# EAGLE design MF01.v1.6 (EAGLE 7.5.0)

## Sheet 1 of 3
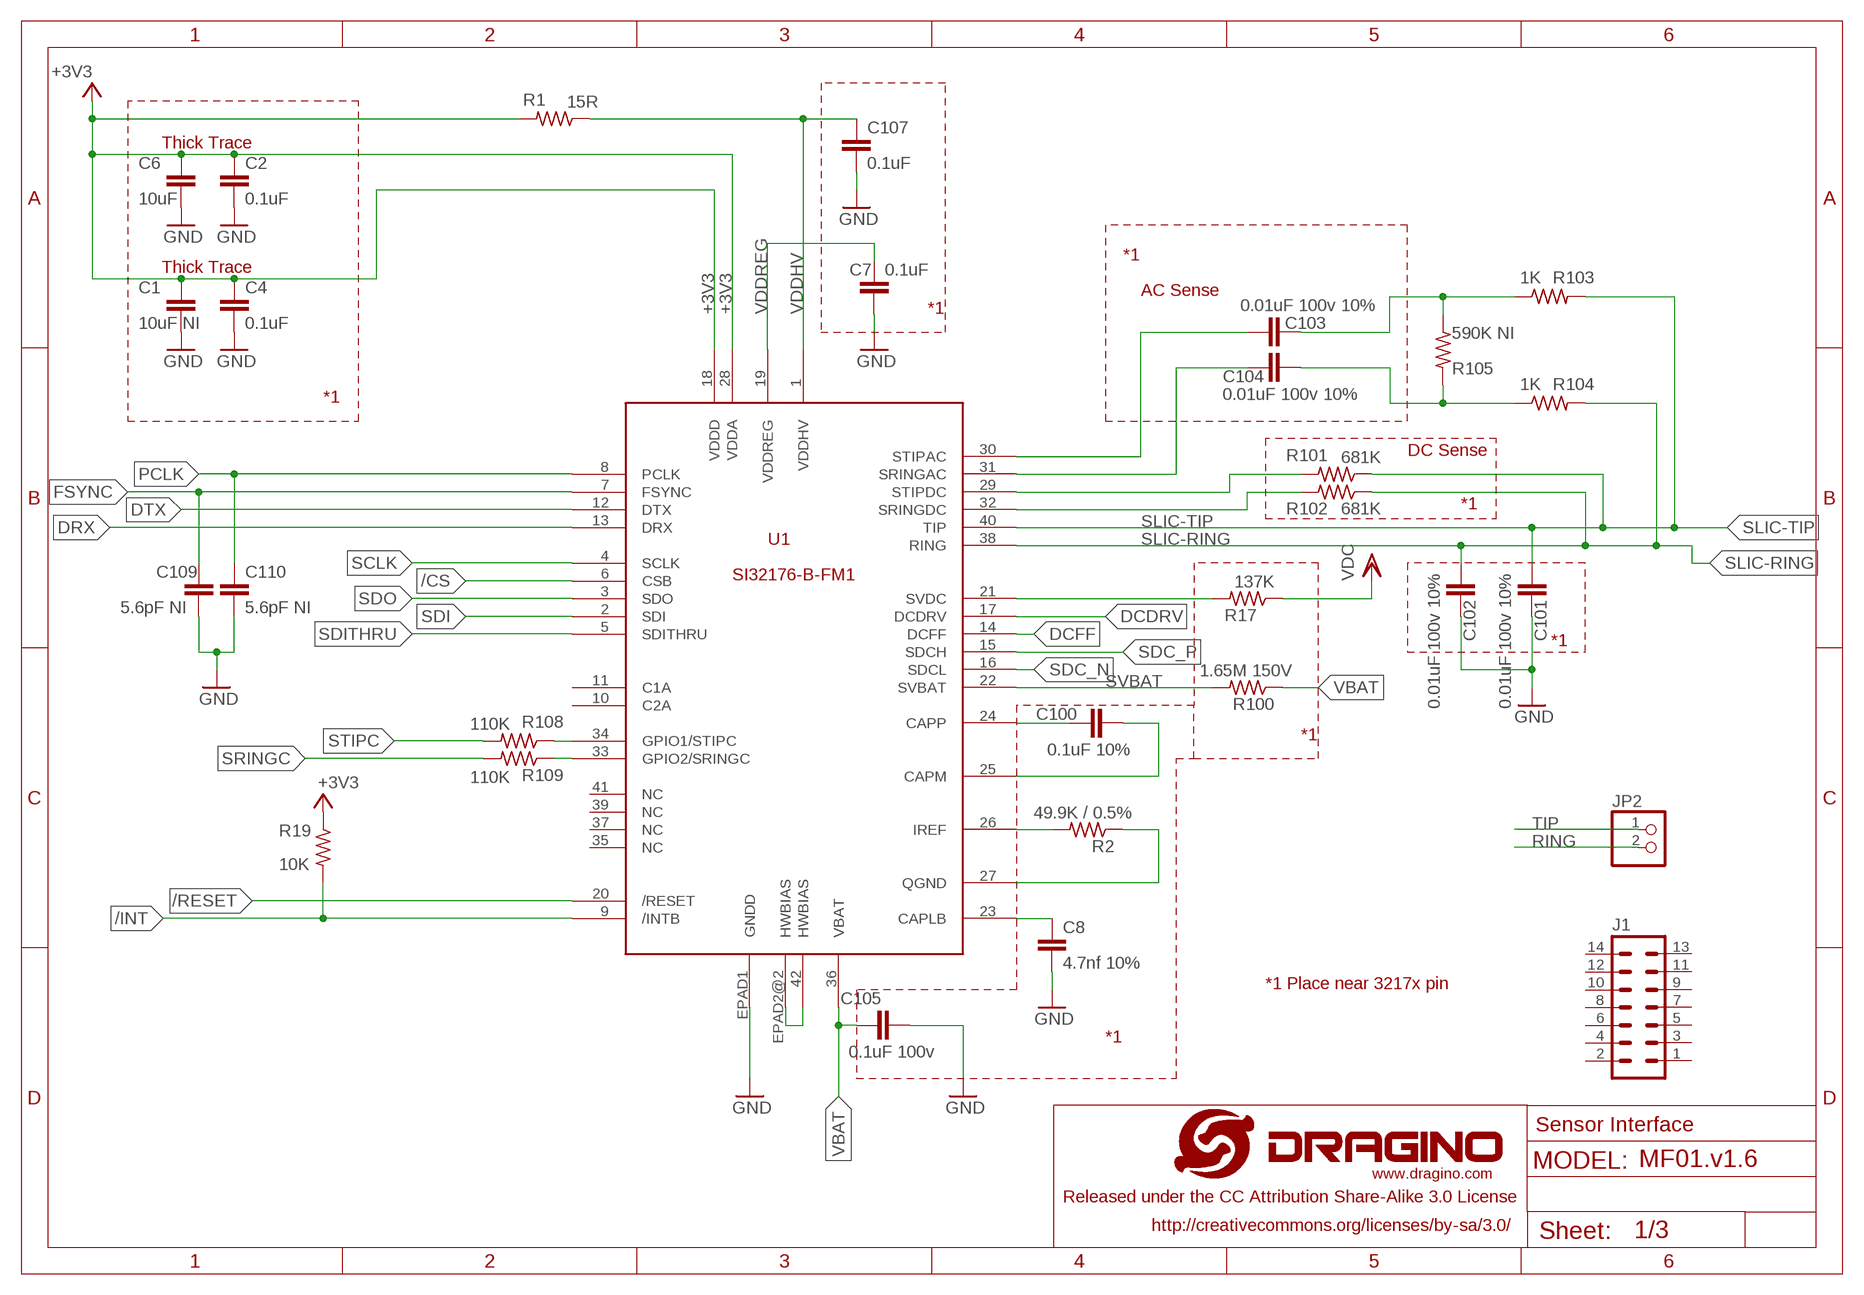
[diagram p0: schematic, sheet 1]

### Parts
C1  10uF NI  C-EUC0603  [C0603]
C2  0.1uF  C-EUC0402  [C0402]
C4  0.1uF  C-EUC0402  [C0402]
C6  10uF  C-EUC0603  [C0603]
C7  0.1uF  C-EUC0402  [C0402]
C8  4.7nf 10%  C-EUC0402  [C0402]
C100  0.1uF 10%  C-EUC0402  [C0402]
C101  0.01uF 100v 10%  C-EUC0603  [C0603]
C102  0.01uF 100v 10%  C-EUC0603  [C0603]
C103  0.01uF 100v 10%  C-EUC0603  [C0603]
C104  0.01uF 100v 10%  C-EUC0603  [C0603]
C105  0.1uF 100v  C-EUC0603  [C0603]
C107  0.1uF  C-EUC0402  [C0402]
C109  5.6pF NI  C-EUC0402  [C0402]
C110  5.6pF NI  C-EUC0402  [C0402]
J1  MA07-2  [MA07-2]
JP2  PINHD-1X2  [1X02]
R1  15R  R-US_R0805  [R0805]
R2  49.9K / 0.5%  R-US_R0402  [R0402]
R17  137K  R-US_R0402  [R0402]
R19  10K  R-US_R0402  [R0402]
R100  1.65M 150V  R-US_R0805  [R0805]
R101  681K  R-US_R0805  [R0805]
R102  681K  R-US_R0805  [R0805]
R103  1K  R-US_R0603  [R0603]
R104  1K  R-US_R0603  [R0603]
R105  590K NI  R-US_R0805  [R0805]
R108  110K  R-US_R0402  [R0402]
R109  110K  R-US_R0402  [R0402]
U1  SI32176-B-FM1  SI3217X  [SI3217X-QFN42]

### Nets
+3V3: C1.2 C2.2 C4.2 C6.2 R1.2 R19.1 U1.18(VDDD) U1.28(VDDA) ; also sheet 2
/CS: U1.6(CSB) ; also sheet 2
/INT: R19.2 U1.9(/INTB) ; also sheet 2
/RESET: U1.20(/RESET) ; also sheet 2
DCDRV: U1.17(DCDRV) ; also sheet 2
DCFF: U1.14(DCFF) ; also sheet 2
DRX: U1.13(DRX) ; also sheet 2
DTX: U1.12(DTX) ; also sheet 2
EPAD2: U1.42(HWBIAS) U1.EPAD2@2(HWBIAS)
FSYNC: C109.2 U1.7(FSYNC) ; also sheet 2
GND [gnd]: C1.1 C2.1 C4.1 C6.1 C7.1 C8.2 C101.2 C102.2 C105.1 C107.1 C109.1 C110.1 U1.EPAD1(GNDD) ; also sheet 2,3
N$1: R102.2 U1.32(SRINGDC)
N$11: R2.2 U1.26(IREF)
N$12: C8.1 U1.23(CAPLB)
N$16: R2.1 U1.27(QGND)
N$58: C100.1 U1.24(CAPP)
N$59: C100.2 U1.25(CAPM)
N$60: R101.2 U1.29(STIPDC)
N$61: C104.1 U1.31(SRINGAC)
N$62: C103.1 U1.30(STIPAC)
N$63: C104.2 R104.1 R105.2
N$64: C103.2 R103.1 R105.1
N$65: R17.2 U1.21(SVDC)
N$66: R108.1 U1.34(GPIO1/STIPC)
N$67: R109.1 U1.33(GPIO2/SRINGC)
PCLK: C110.2 U1.8(PCLK) ; also sheet 2
RING: JP2.2 ; also sheet 3
SCLK: U1.4(SCLK) ; also sheet 2
SDC_N: U1.16(SDCL) ; also sheet 2
SDC_P: U1.15(SDCH) ; also sheet 2
SDI: U1.2(SDI) ; also sheet 2
SDITHRU: U1.5(SDITHRU)
SDO: U1.3(SDO) ; also sheet 2
SLIC-RING: C102.1 R102.1 R104.2 U1.38(RING) ; also sheet 3
SLIC-TIP: C101.1 R101.1 R103.2 U1.40(TIP) ; also sheet 3
SRINGC: R109.2 ; also sheet 3
STIPC: R108.2 ; also sheet 3
SVBAT: R100.2 U1.22(SVBAT)
TIP: JP2.1 ; also sheet 3
VBAT: C105.2 R100.1 U1.36(VBAT) ; also sheet 2
VDC: R17.1 ; also sheet 2
VDDHV: C107.2 R1.1 U1.1(VDDHV)
VDDREG: C7.2 U1.19(VDDREG)
Unconnected: J1.1 J1.2 J1.3 J1.4 J1.5 J1.6 J1.7 J1.8 J1.9 J1.10 J1.11 J1.12 J1.13 J1.14 U1.10(C2A) U1.11(C1A) U1.35(NC) U1.37(NC) U1.39(NC) U1.41(NC)

### Notes on the sheet
- Thick Trace
- Thick Trace | *1
- AC Sense
- *1
- *1
- DC Sense
- *1
- *1
- *1
- *1 Place near 3217x pin
- *1
- Sensor Interface

## Sheet 2 of 3
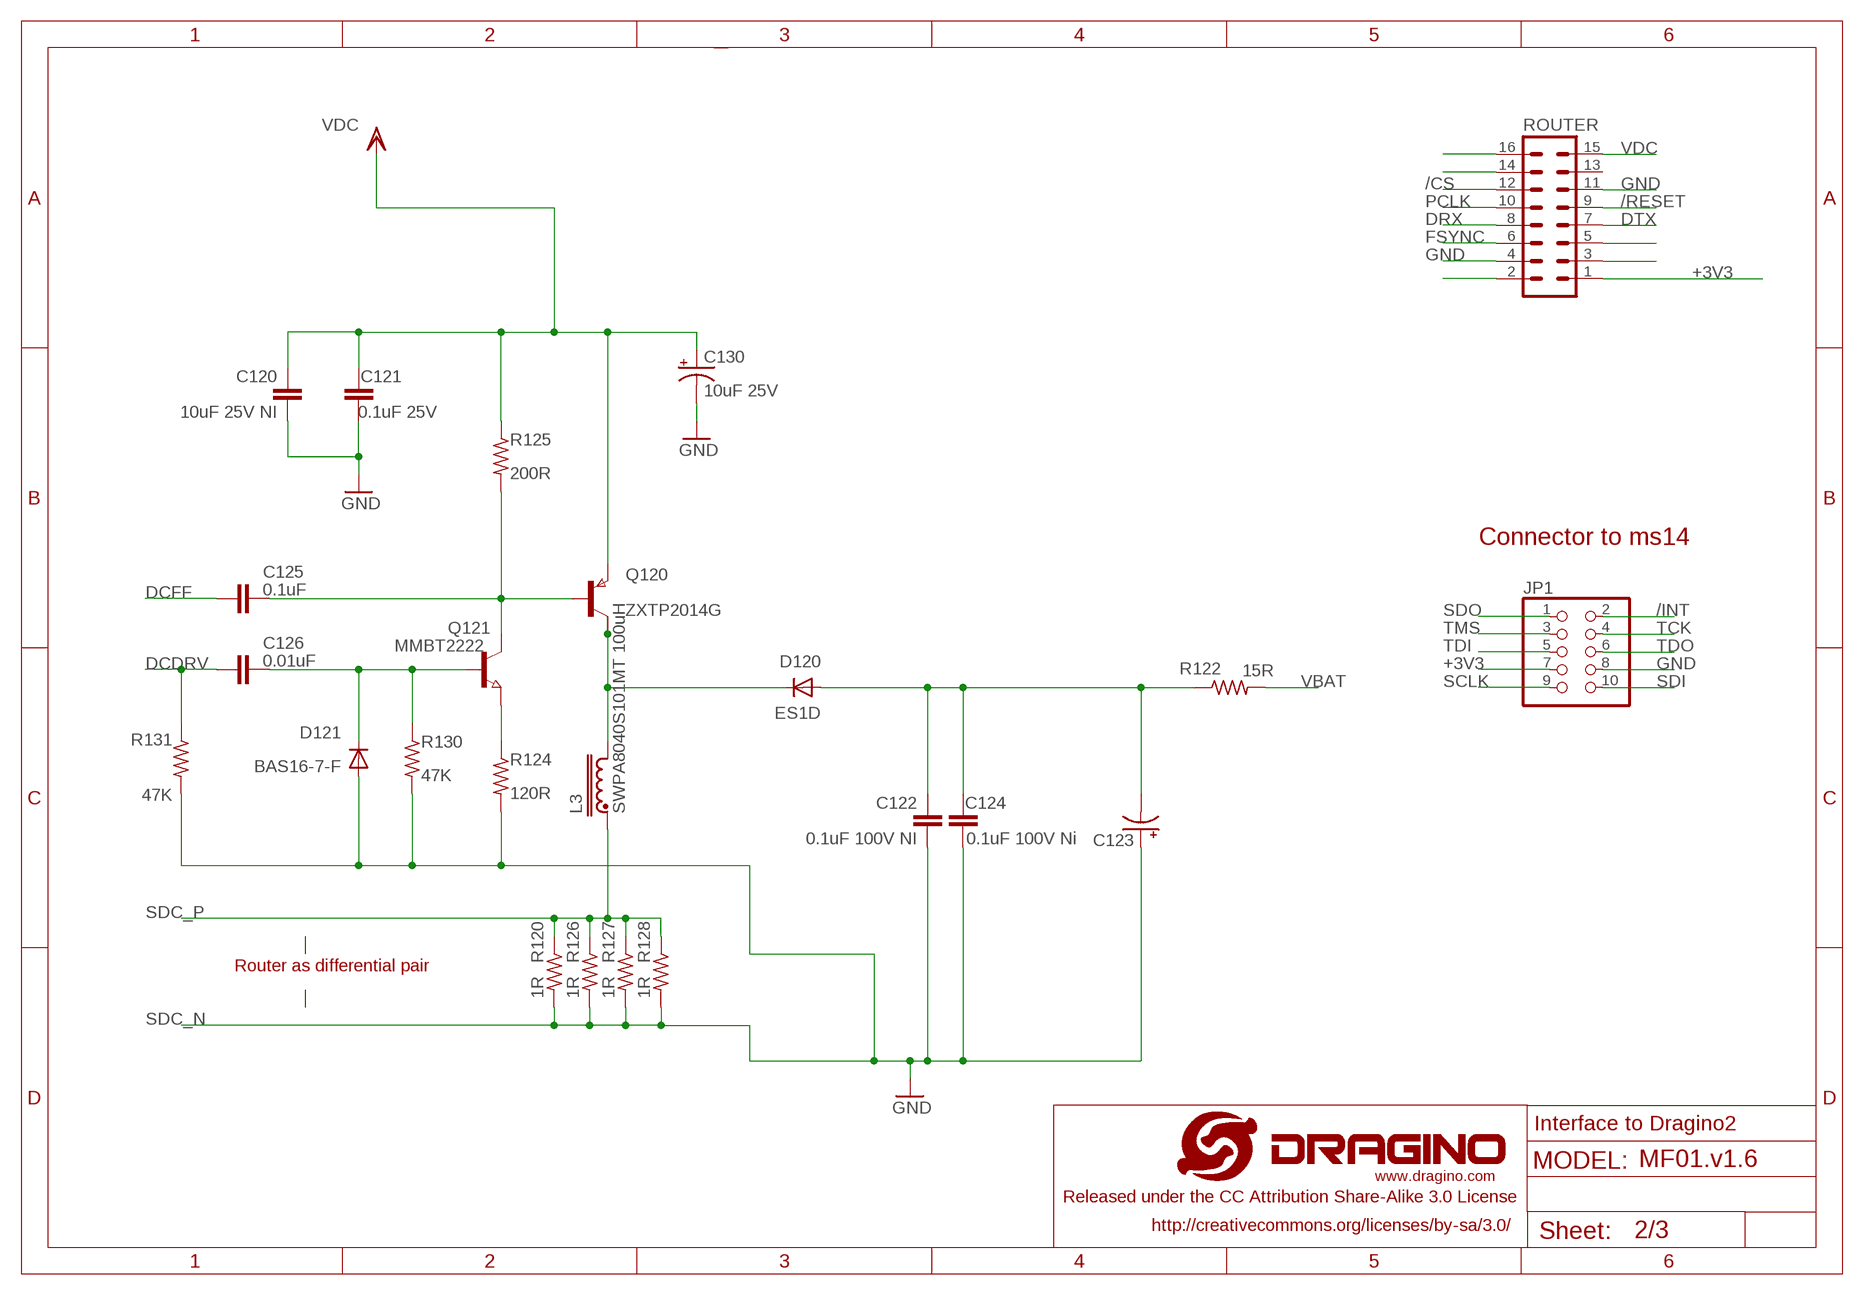
[diagram p1: schematic, sheet 2]

### Parts
C120  10uF 25V NI  C-EUC1206  [C1206]
C121  0.1uF 25V  C-EUC0402  [C0402]
C122  0.1uF 100V NI  C-EUC0603  [C0603]
C123  CPOL-US153CLV-0605  [153CLV-0605]
C124  0.1uF 100V Ni  C-EUC0603  [C0603]
C125  0.1uF  C-EUC0402  [C0402]
C126  0.01uF  C-EUC0402  [C0402]
C130  10uF 25V  CPOL-USUD-4X5,8  [UD-4X5,8_NICHICON]
D120  ES1D  CGRM4001-G  [SOD-123_MINI-SMA]
D121  BAS16-7-F  [SOT23]
JP1  PINHD-2X5_2.00  [2X05M]
L3  SWPA8040S101MT 100uH  INDUCTORLVS808040  [LVS808040]
Q120  ZXTP2014G  PNPSOT223  [SOT223]
Q121  MMBT2222  NPN-TRANSISTOR_SOT23  [SOT23]
R120  1R  R-US_R0402  [R0402]
R122  15R  R-US_R0805  [R0805]
R124  120R  R-US_R0402  [R0402]
R125  200R  R-US_R0603  [R0603]
R126  1R  R-US_R0402  [R0402]
R127  1R  R-US_R0402  [R0402]
R128  1R  R-US_R0402  [R0402]
R130  47K  R-US_R0402  [R0402]
R131  47K  R-US_R0402  [R0402]
ROUTER  MA08-2  [MA08-2]
U$5  LOGO-NEW  [LOGO-SILK-NEW]

### Nets
+3V3: JP1.7 ROUTER.1 ; also sheet 1
/CS: ROUTER.12 ; also sheet 1
/INT: JP1.2 ; also sheet 1
/RESET: ROUTER.9 ; also sheet 1
DCDRV: C126.2 R131.1 ; also sheet 1
DCFF: C125.2 ; also sheet 1
DRX: ROUTER.8 ; also sheet 1
DTX: ROUTER.7 ; also sheet 1
FSYNC: ROUTER.6 ; also sheet 1
GND [gnd]: C120.2 C121.2 C122.2 C123.+ C124.2 C130.- D121.1(A) JP1.8 R124.2 R130.2 R131.2 ROUTER.4 ROUTER.11 ; also sheet 1,3
N$4: ROUTER.3
N$8: C126.1 D121.3(C) Q121.1(B) R130.1
N$9: Q121.2(E) R124.1
N$68: C125.1 Q120.1(B) Q121.3(C) R125.2
N$69: D120.C L3.P$2 Q120.2(C) Q120.4(C)
N$70: C122.1 C123.- C124.1 D120.A R122.1
N$73: ROUTER.5
N$74: ROUTER.16
N$75: ROUTER.14
N$76: ROUTER.2
PCLK: ROUTER.10 ; also sheet 1
SCLK: JP1.9 ; also sheet 1
SDC_N: R120.2 R126.2 R127.2 R128.2 ; also sheet 1
SDC_P: L3.P$1 R120.1 R126.1 R127.1 R128.1 ; also sheet 1
SDI: JP1.10 ; also sheet 1
SDO: JP1.1 ; also sheet 1
TCK: JP1.4
TDI: JP1.5
TDO: JP1.6
TMS: JP1.3
VBAT: R122.2 ; also sheet 1
VDC: C120.1 C121.1 C130.+ Q120.3(E) R125.1 ROUTER.15 ; also sheet 1
Unconnected: ROUTER.13

### Notes on the sheet
- Connector to ms14
- Router as differential pair
- Interface to Dragino2

## Sheet 3 of 3
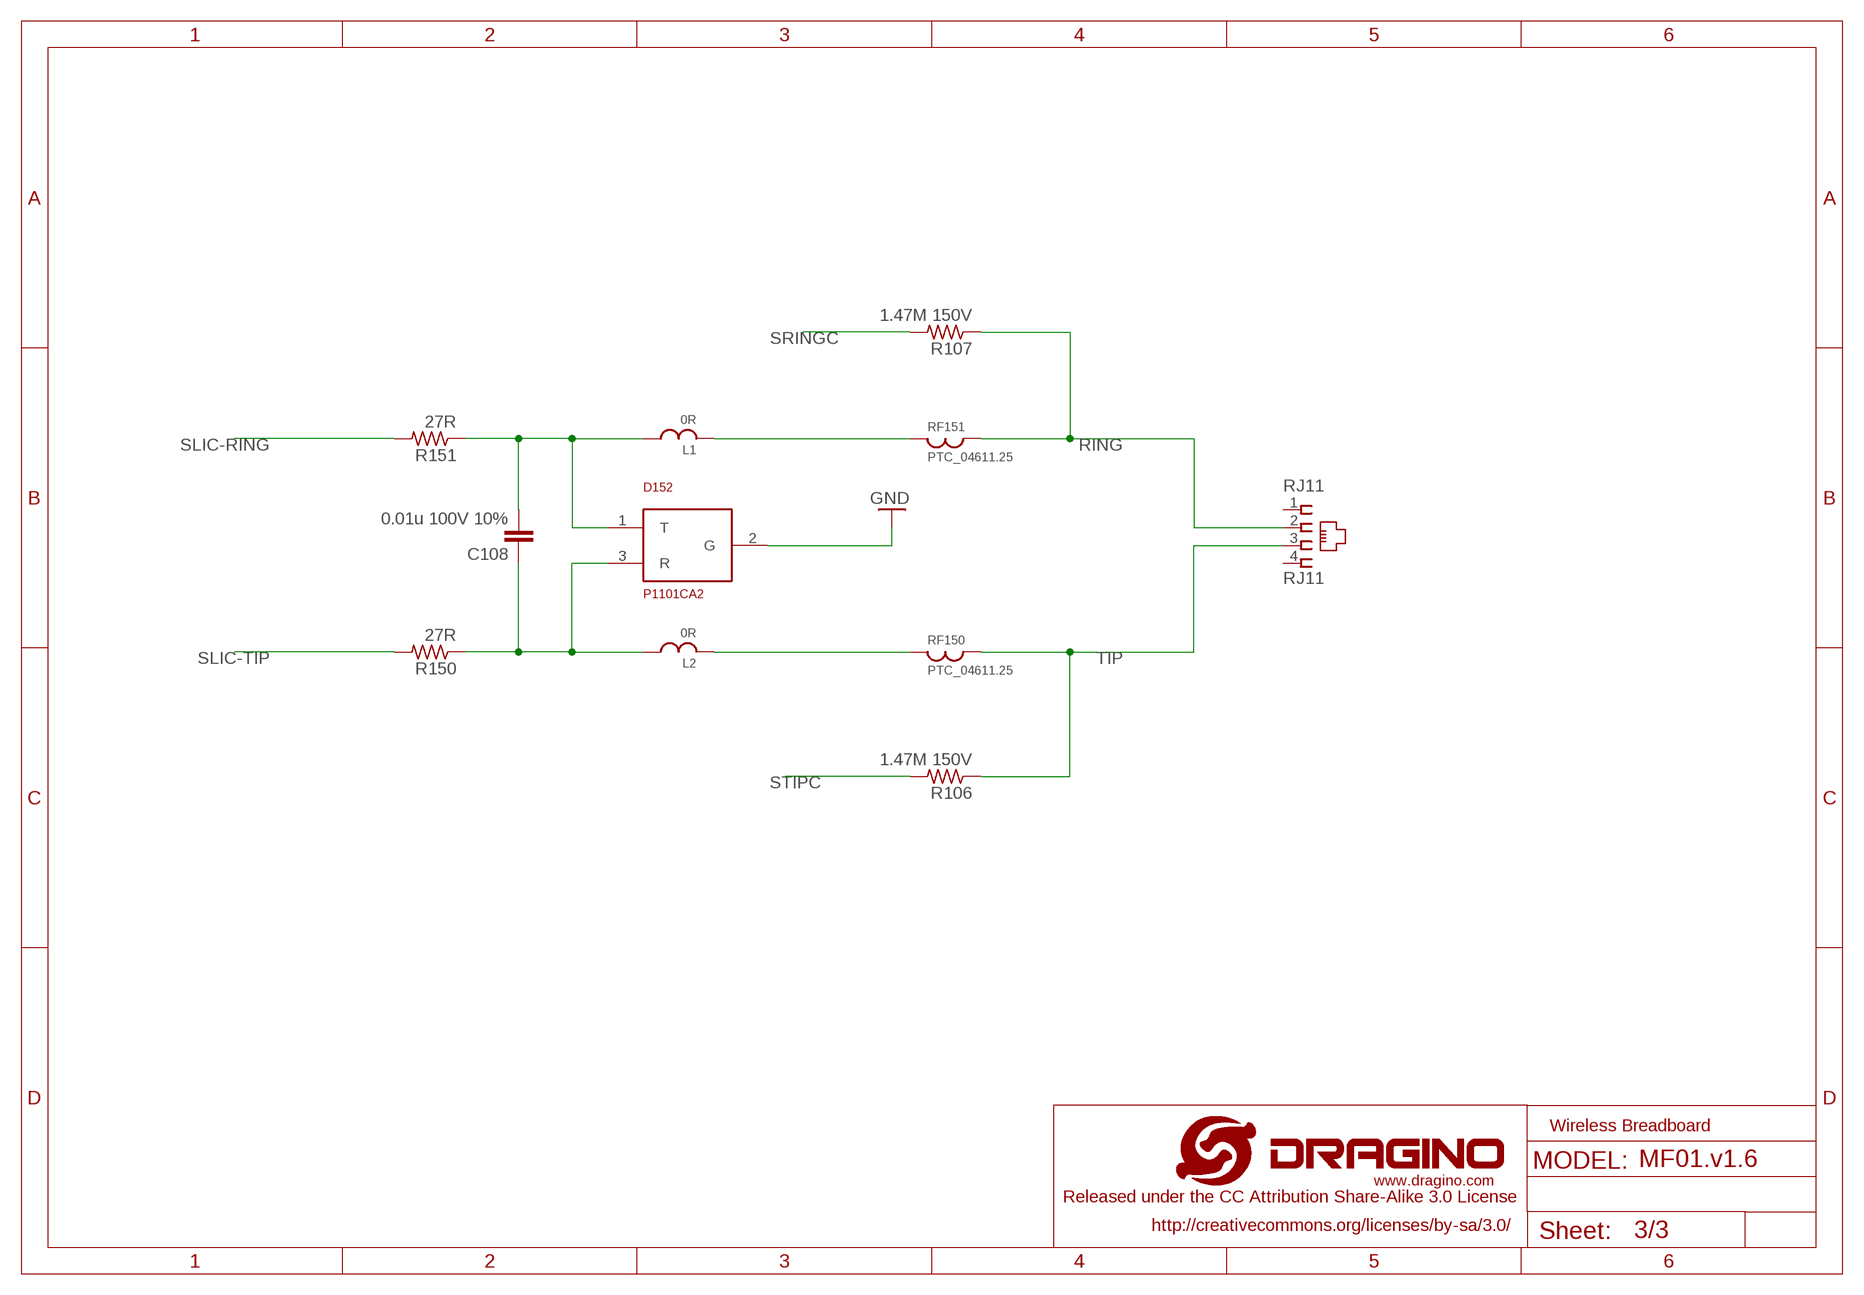
[diagram p2: schematic, sheet 3]

### Parts
C108  0.01u 100V 10%  C-EUC0603  [C0603]
D152  P1101CA2  SLIC_PROTECTORP1101CA2  [DO-214]
L1  0R  BEADS0805  [C0805]
L2  0R  BEADS0805  [C0805]
R106  1.47M 150V  R-US_R1206  [R1206]
R107  1.47M 150V  R-US_R1206  [R1206]
R150  27R  R-US_R0805  [R0805]
R151  27R  R-US_R0805  [R0805]
RF150  PTC_04611.25  [04611.25]
RF151  PTC_04611.25  [04611.25]
RJ11  RJ11  14867RJ11  [14867]

### Nets
GND [gnd]: D152.2(G) ; also sheet 1,2
N$3: L1.1 RF151.P1
N$5: L2.1 RF150.P1
N$71: C108.1 D152.3(R) L2.2 R150.1
N$72: C108.2 D152.1(T) L1.2 R151.1
RING: R107.1 RF151.P2 RJ11.2 ; also sheet 1
SLIC-RING: R151.2 ; also sheet 1
SLIC-TIP: R150.2 ; also sheet 1
SRINGC: R107.2 ; also sheet 1
STIPC: R106.2 ; also sheet 1
TIP: R106.1 RF150.P2 RJ11.3 ; also sheet 1
Unconnected: RJ11.1 RJ11.4

### Notes on the sheet
- Wireless Breadboard

## Library data of the parts
C1 C2 C4 C6-C8 C100-C105 C107-C110 C120-C122 C124-C126 = dragino:C-EU: CAPACITOR, European symbol
C123 = dragino:CPOL-US: POLARIZED CAPACITOR, American symbol
C130 = rcl:CPOL-US: POLARIZED CAPACITOR, American symbol
D120 = diode:CGRM400*-G: Molded plasitc,JEDEC SOD-123/Mini SMA Source: Comchip CGRM4001-G.pdf
D121 = dragino:BAS16-7-F
D152 = dragino:SLIC_PROTECTOR
J1 = dragino:MA07-2: PIN HEADER; OC_FARNELL: unknown; OC_NEWARK: unknown
JP1 = dragino:PINHD-2X5: PIN HEADER
JP2 = pinhead:PINHD-1X2: PIN HEADER
L1 L2 = dragino:BEADS
L3 = dragino-passive:INDUCTOR: CHOKE U15
Q120 = zetex:PNPSOT223: PNP TRANSISTOR; MPN: DJT4030P-13; OC_FARNELL: 1710675; OC_NEWARK: 25R4489
Q121 = semicon-smd-ipc:NPN-TRANSISTOR_: NPN TRANSISTOR
R1 R2 R17 R19 R100-R109 R120 R122 R124-R128 R130 R131 R150 R151 = dragino:R-US_: RESISTOR, American symbol
RF150 RF151 = dragino:PTC_04611.25
RJ11 = dragino:14867: RJ11 Connector Source: 4UCON TECHNOLOGY INC. 14867.pdf; OC_FARNELL: unknown; OC_NEWARK: unknown
ROUTER = dragino:MA08-2: PIN HEADER; OC_FARNELL: unknown; OC_NEWARK: unknown
U1 = dragino:SI3217X
U$5 = dragino:LOGO-NEW

## Net classes
0 default: width 0.203 mm, clearance 0.254 mm
1 power: width 0.61 mm, drill 0.61 mm, clearance 0.254 mm
2 gnd: width 0.305 mm, drill 0.33 mm, clearance 0.254 mm
3 usbvcc: width 0.508 mm, drill 0.61 mm, clearance 0.254 mm
4 aref: width 0.406 mm, drill 0.61 mm, clearance 0.254 mm
5 usbtrace: width 0.254 mm, clearance 0.152 mm

## Board
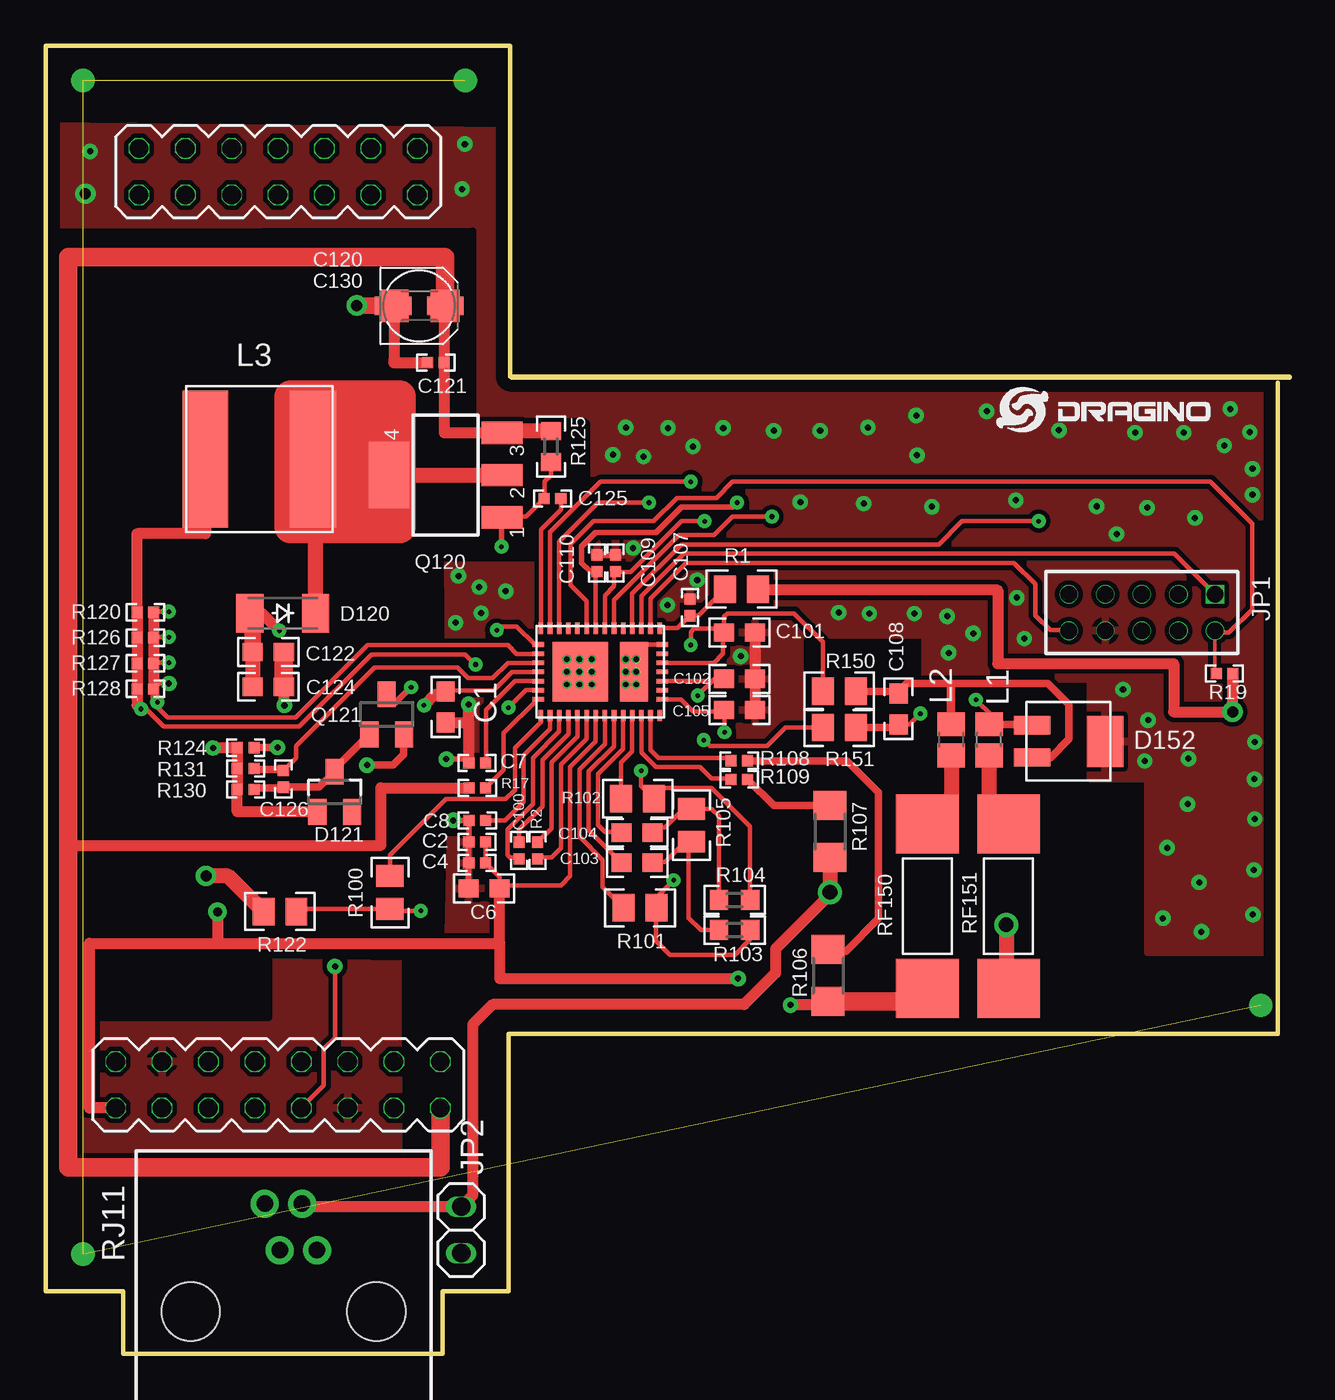
[diagram p3: board, top side]
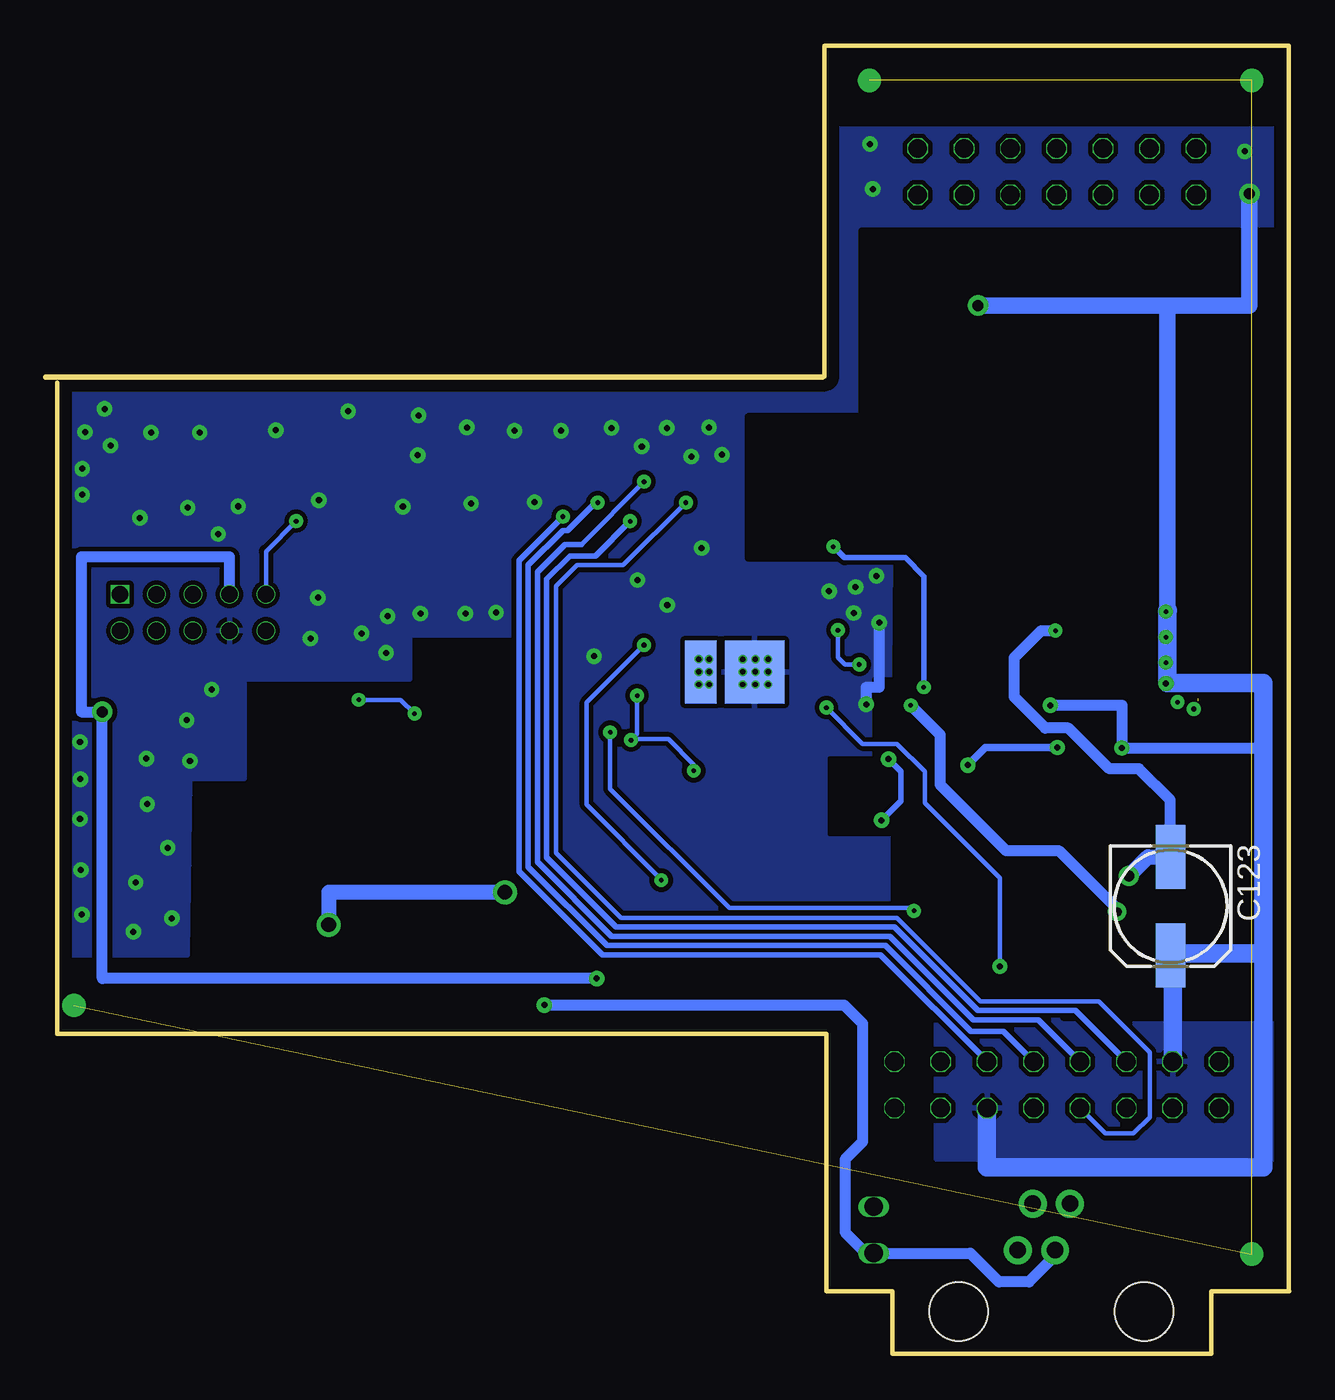
[diagram p4: board, bottom side, seen from below]

Size 68.09 x 71.63 mm. Coordinates in mm from the lower left corner, seen from the top.
Outline: 25.44,53.5 25.44,71.63 0.02,71.63 0.02,3.43
Outline: 67.45,53.19 67.45,17.53 25.35,17.53 25.35,3.43 21.73,3.43 21.73,0 4.26,0 4.26,3.43 0.02,3.43
Outline: 0.02,3.43 0,3.43
Outline: 25.54,53.47 68.09,53.47
Copper layers (1*16): Top 0.035mm / dielectric 1.5mm / Bottom 0.035mm
Design rules "default *": minimum track width 10mil, minimum drill 10mil, track to track 6mil, track to pad 7mil, pad to pad 7mil, via to via 10mil, smd to smd 7mil, copper to edge 26mil, drill to drill 10mil, minimum pad ring 1mil, minimum via ring 10mil, stop-mask expansion 1mil, vias tented up to drill 30mil, thermal gap 10mil
tRestrict: area 0.3,18.2 to 29.6,61.5; area 21.4,28.4 to 25.2,37
bRestrict: area 0.2,18.4 to 29.6,61.5; area 21.4,28.4 to 25.2,37

### Footprints (pad centres in the part's own frame; a part is rotated, then mirrored left to right if it is on the bottom)
C0603 = smd 1.1 x 1: 1 -0.85,0; 2 0.85,0
C0402 = smd 0.61 x 0.61: 1 -0.457,0; 2 0.457,0
C1206 = smd 1.6 x 1.8: 1 -1.4,0; 2 1.4,0
153CLV-0605 = smd 3.5 x 1.6: + 2.7,0; - -2.7,0
UD-4X5,8_NICHICON = smd 2 x 1: + 1.425,0; - -1.425,0
SOD-123_MINI-SMA = smd 1.5 x 2.1: A 1.8,0; C -1.8,0
SOT23 = smd 1 x 1.4: 1 -0.95,-1.1; 2 0.95,-1.1; 3 0,1.1
DO-214 = smd 2 x 1: 1 4,-0.88; 3 4,0.88 | smd 2 x 2.8: 2 0,0
MA07-2 = drill 1.016 octagon: 1 -7.62,-1.27; 2 -7.62,1.27; 3 -5.08,-1.27; 4 -5.08,1.27; 5 -2.54,-1.27; 6 -2.54,1.27; 7 0,-1.27; 8 0,1.27; 9 2.54,-1.27; 10 2.54,1.27; 11 5.08,-1.27; 12 5.08,1.27; 13 7.62,-1.27; 14 7.62,1.27
2X05M = drill 0.914 square: 1 -4,-1 | drill 0.914: 2 -4,1; 3 -2,-1; 4 -2,1; 5 0,-1; 6 0,1; 7 2,-1; 8 2,1; 9 4,-1; 10 4,1
1X02 = drill 1.016 long: 1 -1.27,0; 2 1.27,0
C0805 = smd 1.3 x 1.5: 1 -0.85,0; 2 0.85,0
LVS808040 = smd 2.5 x 7.5: P$1 -2.95,0; P$2 2.95,0
SOT223 = smd 1.219 x 2.235: 1 -2.311,-3.099; 2 0,-3.099; 3 2.311,-3.099 | smd 3.6 x 2.2: 4 0,3.099
R0805 = smd 1.2 x 1.5: 1 -0.9,0; 2 0.9,0
R0402 = smd 0.61 x 0.61: 1 -0.457,0; 2 0.457,0
R0603 = smd 1 x 1.1: 1 -0.85,0; 2 0.85,0
R1206 = smd 1.6 x 1.803: 1 -1.422,0; 2 1.422,0
04611.25 = smd 3.25 x 3.43: P1 -4.5,0; P2 4.5,0
14867 = drill 0.9 pad 1.524: 1 1.84,3.36; 2 1.02,5.9; 3 -0.2,3.36; 4 -1.02,5.9 | hole 3.2: -5.08,0; 5.08,0
MA08-2 = drill 1.016 octagon: 1 -8.89,-1.27; 2 -8.89,1.27; 3 -6.35,-1.27; 4 -6.35,1.27; 5 -3.81,-1.27; 6 -3.81,1.27; 7 -1.27,-1.27; 8 -1.27,1.27; 9 1.27,-1.27; 10 1.27,1.27; 11 3.81,-1.27; 12 3.81,1.27; 13 6.35,-1.27; 14 6.35,1.27; 15 8.89,-1.27; 16 8.89,1.27
SI3217X-QFN42 = smd 0.625 x 0.25: 1 -2.388,3.25; 2 -2.388,2.75; 3 -2.388,2.25; 4 -2.388,1.75; 5 -2.388,1.25; 6 -2.388,0.75; 7 -2.388,0.25; 8 -2.388,-0.25; 9 -2.388,-0.75; 10 -2.388,-1.25; 11 -2.388,-1.75; 12 -2.388,-2.25; 13 -2.388,-2.75; 14 -2.388,-3.25; 22 2.388,-3.25; 23 2.388,-2.75; 24 2.388,-2.25; 25 2.388,-1.75; 26 2.388,-1.25; 27 2.388,-0.75; 28 2.388,-0.25; 29 2.388,0.25; 30 2.388,0.75; 31 2.388,1.25; 32 2.388,1.75; 33 2.388,2.25; 34 2.388,2.75; 35 2.388,3.25 | smd 0.25 x 0.625: 15 -1.5,-3.388; 16 -1,-3.388; 17 -0.5,-3.388; 18 0,-3.388; 19 0.5,-3.388; 20 1,-3.388; 21 1.5,-3.388; 36 1.5,3.388; 37 1,3.388; 38 0.5,3.388; 39 0,3.388; 40 -0.5,3.388; 41 -1,3.388; 42 -1.5,3.388 | smd 3.45 x 3.25 bottom: EPAD1 0,-1.1 | smd 3.45 x 1.75 bottom: EPAD2@1 0,1.85 | smd 3.25 x 1.55: EPAD2@2 0,1.85 | smd 3.25 x 3.05: EPAD4 0,-1.1 | drill 0.3 pad 0.45: P$2 0,1.959; P$3 0.689,1.959; P$4 -0.689,1.397; P$6 0,1.397; P$7 0.689,-0.454; P$8 0.689,-1.143; P$9 0.689,-1.832; P$10 0,-1.832; P$11 0,-1.143; P$12 0,-0.454; P$13 -0.689,-0.454; P$14 -0.689,-1.143; P$15 -0.689,-1.832; P$16 0.689,1.397; P$17 -0.7,1.959

### Placement (x,y rotation side)
C1  21.9,35.42 90 top
C2  23.62,28.03 0 top
C4  23.62,26.88 0 top
C6  24,25.49 0 top
C7  23.62,32.35 0 top
C8  23.64,29.21 180 top
C100  25.92,27.56 90 top
C101  37.99,39.5 0 top
C102  37.99,36.96 0 top
C103  32.39,26.88 0 top
C104  32.39,28.54 0 top
C105  37.99,35.26 180 top
C107  35.28,40.87 270 top
C108  46.7,35.31 270 top
C109  31.2,43.29 270 top
C110  30.19,43.29 270 top
C120  20.48,57.38 180 top
C121  21.37,54.27 180 top
C122  12.19,38.43 0 top
C123  6.49,24.51 270 bottom
C124  12.19,36.53 0 top
C125  27.75,46.82 0 top
C126  13.02,31.48 90 top
C130  20.45,57.38 0 top
D120  12.98,40.55 180 top
D121  15.83,30.77 0 top
D152  58.01,33.53 180 top
J1  12.72,64.73 0 top
JP1  60.02,40.6 180 top
JP2  22.75,6.78 90 top
L1  51.65,33.62 90 top
L2  49.59,33.62 90 top
L3  11.7,49 0 top
Q120  21.9,48.12 90 top
Q121  18.67,35.01 0 top
R1  38.1,41.87 0 top
R2  26.94,27.56 90 top
R17  23.64,30.99 0 top
R19  64.55,37.25 180 top
R100  18.85,25.26 90 top
R101  32.54,24.42 180 top
R102  32.41,30.39 180 top
R103  37.72,23.2 0 top
R104  37.72,24.85 0 top
R105  35.36,28.94 90 top
R106  42.84,20.72 90 top
R107  42.94,28.6 90 top
R108  37.98,32.47 0 top
R109  37.98,31.46 0 top
R120  5.46,40.6 0 top
R122  12.83,24.22 0 top
R124  10.95,33.19 180 top
R125  27.66,49.67 270 top
R126  5.46,39.2 0 top
R127  5.46,37.81 0 top
R128  5.46,36.41 0 top
R130  10.95,30.9 180 top
R131  10.95,32.05 180 top
R150  43.46,36.28 180 top
R151  43.46,34.29 180 top
RF150  48.28,24.51 270 top
RF151  52.72,24.51 270 top
RJ11  13.02,2.32 0 top
ROUTER  12.72,14.73 0 top
U1  30.37,37.34 270 top
U$5  52.07,50.47 0 top

### Tracks (layer width: path | path; a pad name or v marks a point on that pad's centre or on a via)
+3V3  (via drill 0.25, 0.33, 0.5, 0.6)
  Top 0.254: C2.2 C4.2 24.85,26.11 C6.2 25.02,25.65 25.03,25.65 | C1.2 21.95,36.32 22.06,36.32 | U1.18 25.54,37.34 24.53,36.32 22.06,36.32 | 22.06,36.32 21.84,36.09 | U1.28 30.12,33.53 28.72,32.13 28.72,26.16 28.21,25.65 25.03,25.65 | 25.03,25.65 C6.2
  Top 0.61: ROUTER.1 2.4,13.46 2.4,22.48 9.57,22.48 | 9.57,22.48 24.86,22.48 | 24.86,22.48 C6.2 | 65,36.17 R19.1 65,35.15 v64.99,35.15 61.76,35.15 61.76,37.8 52.14,37.8 52.14,41.81 39,41.81 R1.2 | 21.84,36.09 21.3,36.09 v20.72,35.51 | v9.41,24.21 9.41,22.63 9.57,22.48 | 24.86,22.48 24.86,20.55 v37.91,20.55
  Bottom 0.61: v20.72,35.51 19.12,33.91 19.12,31.17 15.51,27.56 12.61,27.56 9.41,24.36 v9.41,24.21 | v37.91,20.55 64.99,20.55 v64.99,35.15 66.13,35.15 66.13,43.64 58.02,43.64 JP1.7
/CS  (via drill 0.25)
  Top 0.254: U1.6 31.13,39.74 31.13,41.27 34.69,44.83 36.59,44.83 37.61,45.85 v39.77,45.85
  Bottom 0.305: ROUTER.12 22.38,21.84 37.61,21.84 42.18,26.42 42.18,43.43 v39.77,45.85
/INT
  Top 0.203: R19.2 64.02,37.32 JP1.2
  Top 0.254: JP1.2 64.12,39.5 64.79,39.5 66.06,40.77 66.06,45.47 63.77,47.75 37.61,47.75 36.72,46.86 34.56,46.86 33.29,45.59 29.99,45.59 28.74,44.35 28.74,42.09 29.62,41.21 U1.9
/RESET  (via drill 0.25, 0.33)
  Top 0.254: U1.20 26.3,36.34 v25.34,35.38 | v15.84,21.21 15.84,17.3 15.23,16.69 15.23,14.7 ROUTER.9
  Bottom 0.254: v15.84,21.21 15.84,26.06 19.95,30.17 19.95,31.88 21.48,33.4 23.36,33.4 v25.34,35.38
DCDRV
  Top 0.254: R131.1 11.52,32.05 11.57,32 | U1.17 25.31,37.84 24.48,37.01 23.13,37.01 22.55,37.59 18.02,37.59 13.71,33.27 13.71,32.62 C126.2
  Top 0.406: 11.57,32 12.96,32 C126.2
DCFF
  Top 0.254: C125.2 28.21,46.23 27.12,45.14 U1.14
DRX  (via drill 0.25)
  Top 0.254: U1.13 27.62,45 29.92,47.31 30.12,47.5 30.37,47.75 v35.32,47.75
  Bottom 0.254: 38.75,44.32 v35.32,47.75
  Bottom 0.305: ROUTER.8 13.74,18.29 17.29,18.29 21.86,22.86 37.1,22.86 41.16,26.92 41.16,42.8 39.64,44.32 38.75,44.32
DTX  (via drill 0.25)
  Top 0.254: U1.12 28.12,44.49 30.24,46.61 v33.04,46.61
  Bottom 0.254: ROUTER.7 10.06,12.06 8.53,12.06 7.64,12.95 7.64,16.51 10.43,19.3 16.91,19.3 21.48,23.88 36.59,23.88 40.15,27.43 40.15,42.04 39,43.18 36.46,43.18 v33.04,46.61
EPAD2
  Top 0.254: U1.42 32.22,38.84 U1.EPAD2@2
FSYNC  (via drill 0.25)
  Top 0.254: U1.7 30.62,41.52 31.13,42.04 31.13,42.76 C109.2 31.24,42.8 32.02,42.8 34.81,45.59 v36.08,45.59
  Bottom 0.305: ROUTER.6 11.71,18.8 17.03,18.8 21.61,23.37 36.85,23.37 40.66,27.18 40.66,42.42 39.39,43.69 37.99,43.69 v36.08,45.59
GND  (via drill 0.33, 0.6)
  Top 0.305: C120.2 C130.- | C6.1 23.17,25.5 C4.1 C2.1 23.18,28.04 C8.2 v22.32,29.21 | C110.1 C109.1 | 19.07,54.43 18.96,54.53 18.96,57.4 | v21.94,32.56 22.95,32.56 C7.1
  Top 0.61: C120.2 19.07,57.38 19.07,54.43 19.07,54.27 C121.2 | v9.16,33.17 R124.2 R131.2 R130.2 10.49,29.67 D121.1 | v13.07,35.51 13.07,37.34 13.04,37.34 | C1.1 23.16,34.57 | C7.1 23.17,34.57 23.16,34.57 | 23.16,34.57 v23.16,35.56 | C101.2 C102.2 C105.1
  Top 0.914: 18.96,57.4 v17.03,57.4
  Top 1.016: C122.2 13.04,37.34 C124.2
  Bottom 0.305: 6.49,21.92 1.46,21.92 1.46,21.82 | v22.32,29.21 21.25,30.28 21.25,31.88 v21.94,32.56
  Bottom 0.61: v13.07,35.51 9.16,35.51 v9.16,33.17 1.41,33.17 | v23.16,35.56 23.16,36.5 22.44,36.5 22.44,39.98
  Bottom 0.914: 6.67,40.69 6.67,57.4 v17.03,57.4 2.18,57.4 v2.18,63.52
  Bottom 1.016: ROUTER.11 16.55,13.46 16.55,10.21 1.41,10.21 1.41,21.92 6.49,21.92 C123.+ 6.37,21.81 ROUTER.4 | 1.46,21.82 1.41,21.82 1.41,33.17 1.41,36.73 6.67,36.73 6.67,40.69 6.65,40.69
  other vias: 22.44,40.03 60.32,46.33 51.53,51.61 49.37,40.39 34.05,41 35.68,42.37 32.17,44.12 41.32,46.63 53.58,39.17 60.37,34.7 60.19,32.46 47.56,40.54 38.07,38.2 2.43,65.84 22.95,66.24 22.8,63.78 31.77,50.72 34.08,50.7 37.1,50.7 39.87,50.55 42.41,50.55 45.02,50.72 53.18,41.4 57.55,46.41 23.74,41.99 25.19,41.76 22.6,42.6 23.84,40.56 45.1,40.54 43.42,40.59 49.44,38.38 50.79,39.45 53.13,46.74 62.58,32.59 62.53,30.1 61.41,27.71 63.16,25.81 61.18,23.85 63.29,23.11 66.21,33.5 66.18,31.47 66.21,29.29 66.16,26.49 66.11,24.05 31.05,49.23 59.66,50.44 58.64,44.88 66.08,47.04 44.8,46.56 47.67,51.38 47.72,49.2 55.49,50.57 62.93,45.77 62.32,50.44 64.86,51.74 64.53,49.73 66.08,48.46 65.93,50.47 58.99,36.37 48.53,46.38 32.73,49.12 35.45,49.68
  pour Top (rank 2): -0.14,53.62 -0.14,67.24 25.42,66.96 25.42,53.47 67.86,53.47 68.09,31.62 68.09,21.97 60.34,21.97 60.34,31.5 57.21,31.5 57.21,36.96 48.15,36.96 48.15,39.37 41.29,39.37 41.32,33.15 40.17,32.77 40.15,21.62 19.3,21.58 19.32,10.67 0.02,10.67
  pour Bottom (rank 2): 0.02,18.92 0.02,10.67 19.32,10.67 19.32,21.62 40.15,21.62 40.27,32.77 41.29,33.15 41.29,39.37 48.15,39.37 48.15,36.96 57.21,36.96 57.21,31.5 60.21,31.5 60.34,21.84 68.24,21.84 68.11,31.62 67.86,53.51 25.36,53.51 25.42,67.06 -0.24,67.06 -0.24,53.21
N$1
  Top 0.254: U1.32 32.12,32.99 31.51,32.38 R102.2
N$2  (via drill 0 pad 1.27)  (3 unrouted)
  other vias: 2.05,69.72 22.98,69.72 2.05,5.46 66.54,19.08
N$3
  Top 0.813: L1.1 51.65,30.08 RF151.P1
N$5
  Top 0.813: L2.1 49.59,30.32 RF150.P1
N$8
  Top 0.254: R130.1 11.41,30.95 11.45,30.99
  Top 0.406: 11.45,30.99 12.98,30.99 C126.1 14.98,31.02 D121.3 15.83,32.02 Q121.1
N$9  (via drill 0.33)
  Top 0.406: R124.1 11.42,33.2 v12.69,33.2 | v17.59,32.23 19.02,32.23 19.6,32.82 19.6,33.89 Q121.2
  Bottom 0.406: v12.69,33.2 16.63,33.2 v17.59,32.23
N$11
  Top 0.254: U1.26 29.12,33.8 27.7,32.38 27.7,28.78 R2.2
N$12
  Top 0.254: U1.23 27.62,34.21 26.18,32.77 26.18,30.23 25.16,29.21 C8.1
N$16
  Top 0.254: U1.27 29.62,33.67 28.21,32.26 28.21,27.69 27.7,27.18 27.02,27.18 R2.1
N$58
  Top 0.254: U1.24 28.12,34.07 26.69,32.64 26.69,30.1 25.29,28.7 25.29,27.3 25.42,27.18 25.85,27.18 C100.1
N$59
  Top 0.254: U1.25 28.62,33.94 27.19,32.51 27.19,29.97 25.92,28.7 C100.2
N$60
  Top 0.254: U1.29 30.62,33.4 29.23,32 29.23,28.32 30.5,27.05 30.5,25.57 R101.2
N$61
  Top 0.254: U1.31 31.62,33.13 30.24,31.75 30.24,28.96 30.62,28.57 31.5,28.57 C104.1
N$62
  Top 0.254: U1.30 31.12,33.26 29.73,31.88 29.73,28.69 C103.1
N$63
  Top 0.254: C104.2 33.53,28.83 33.92,28.83 34.94,29.84 R105.2 36.46,29.84 36.87,29.44 R104.1
N$64
  Top 0.254: C103.2 33.28,26.92 33.92,26.92 35.04,28.04 R105.1 35.2,27.88 35.2,23.88 35.87,23.2 R103.1
N$65
  Top 0.254: U1.21 26.94,35.84 25.09,33.98 25.09,31.98 R17.2
N$66
  Top 0.254: U1.34 33.12,33.06 33.54,32.64 37.35,32.64 R108.1
N$67
  Top 0.254: U1.33 32.62,32.93 33.42,32.13 35.83,32.13 36.46,31.5 37.48,31.5 R109.1
N$68  (via drill 0.25)
  Top 0.254: R125.2 27.66,48.09 27.32,47.75 27.32,46.85 C125.1 27.28,46.82 26.3,45.85 25.49,45.85 25.04,45.85 Q120.1 | Q121.3 18.67,35.88 18.96,35.58
  Top 0.305: 18.96,35.58 19.09,35.58 v20.01,36.5 | v24.96,44.2 24.96,45.31 25.49,45.85
  Bottom 0.305: v20.01,36.5 20.01,42.57 21.02,43.59 24.35,43.59 v24.96,44.2
N$69
  Top 0.203: Q120.4 18.8,44.57
  Top 0.254: 14.82,48.16 14.65,48.16 L3.P$2 14.88,49 14.88,49.28
  Top 0.61: 24.29,48.12 24.53,47.88 24.76,47.88 Q120.2
  Top 0.813: Q120.4 24.29,48.12 | D120.C 14.78,47.38 14.82,47.42 14.82,48.16
  Top 1.778: 13.4,49.28 13.4,52.43 19.37,52.43 19.37,45.26 13.4,45.26 13.4,49.28 | 13.4,49.28 14.88,49.28 14.88,51.61 16.65,51.61 16.65,45.97 18.23,45.97 18.23,51.56 18.8,51.56 Q120.4
N$70  (via drill 0.25, 0.6)
  Top 0.61: v12.79,39.6 11.84,40.55 D120.A
  Top 0.813: C122.1 C124.1 | R122.1 9.99,26.16 v8.78,26.16
  Top 0.914: C122.1 11.34,40.39 D120.A
  Bottom 0.254: 7.73,27.21 7.65,27.13 6.52,27.13 6.52,28.63
  Bottom 0.61: 6.52,28.63 6.52,30.33 8.22,32.03 9.85,32.03 12.08,34.27 13.35,34.27 15.05,35.97 15.05,38.12 13.58,39.6 v12.79,39.6
  Bottom 0.813: v8.78,26.16 7.73,27.21 C123.-
N$71
  Top 0.406: R150.1 46.59,36.28 C108.1 46.7,36.27 47.13,36.7 49.42,36.7 49.55,36.58 49.55,34.51 L2.2 49.59,36.66 49.55,36.7 54.88,36.7 56.02,35.56 56.02,33.66 55.01,32.64 54.02,32.64 D152.3
N$72  (via drill 0.25)
  Top 0.254: C108.2 47.31,34.46 v47.89,35.05 | v50.94,35.81 51.83,34.92 51.83,34.65 L1.2
  Top 0.406: R151.1 46.53,34.29 C108.2 | L1.2 53.95,34.47 D152.1
  Bottom 0.254: v47.89,35.05 48.66,35.81 v50.94,35.81
PCLK  (via drill 0.25)
  Top 0.254: U1.8 30.12,42.77 C110.2
  Top 0.305: v37.86,46.61 37.61,46.35 34.81,46.35 33.42,44.96 30.12,44.96 29.35,44.2 29.35,43.31 29.82,42.83 C110.2
  Bottom 0.305: ROUTER.10 15.65,17.65 17.41,17.65 22.11,22.35 37.35,22.35 41.67,26.67 41.67,43.18 39.77,45.08 39.51,45.08 37.99,46.61 v37.86,46.61
RING  (via drill 0.8)
  Top 0.61: v42.94,25.27 42.94,25.15 39.97,22.17 39.97,20.85 38.24,19.13 24.48,19.13 23.38,18.03 23.38,8.69 JP2.2 | JP2.2 14.21,8.05 RJ11.2 | 22.77,8.08 JP2.2
  Top 0.813: R107.1 v42.94,25.27 | v52.59,23.49 52.59,20.14 RF151.P2
  Bottom 0.813: v42.94,25.27 52.59,25.27 v52.59,23.49
SCLK  (via drill 0.25)
  Top 0.254: U1.4 32.12,41.63 34.81,44.32 48.91,44.32 50.18,45.59 v54.37,45.59
  Bottom 0.254: v54.37,45.59 56.02,43.94 JP1.9
SDC_N  (via drill 0.25, 0.33)
  Top 0.254: R120.2 5.92,40.64 | 5.92,40.64 v6.75,40.64 | R126.2 5.92,39.24 v6.75,39.24 | R127.2 5.92,37.85 | 5.92,40.64 5.86,40.64 | v6.75,37.85 5.92,37.85 | 5.92,37.85 5.86,37.85 5.86,36.45 | 5.86,36.32 5.86,35.94 v6.11,35.69 6.11,35.41 6.67,34.85 13.68,34.85 17.64,38.81 25.31,38.81 25.8,38.33 26.97,38.33 U1.16 | 5.86,36.32 5.99,36.45 5.86,36.45 | 5.86,36.45 5.86,36.32 | v6.75,36.7 5.92,36.7 R128.2
  Top 0.406: 5.86,40.64 5.92,40.58
  Top 0.61: 5.92,40.58 5.92,39.24 5.92,37.85 R128.2
SDC_P  (via drill 0.25)  (1 unrouted)
  Top 0.254: R126.1 R127.1 | R128.1 5.01,35.89 | 5.01,35.74 5.06,35.69 | v5.22,35.31 5.5,35.31 6.46,34.34 13.89,34.34 17.85,38.3 22.98,38.3 v23.54,37.74 | v24.7,39.62 24.91,39.83 25.8,39.83 26.79,38.84 U1.15
  Top 0.61: v5.22,35.31 5.01,35.52 5.01,35.89 R127.1 R120.1 5.01,44.91 8.75,44.91 L3.P$1
  Bottom 0.254: v23.54,37.74 24.32,37.74 24.7,38.12 v24.7,39.62
SDI
  Top 0.254: U1.2 33.12,41.36 35.07,43.31 53.03,43.31 54.19,42.14 54.19,40.44 55.01,39.62 56,39.62 JP1.10
SDO
  Top 0.254: U1.3 32.62,41.49 34.94,43.81 61.8,43.81 JP1.1
SLIC-RING  (via drill 0.25)
  Top 0.254: R104.2 38.57,28.88 36.46,30.99 33.91,30.99 R102.1 32.6,31.1 v32.6,31.93 | 36.92,36.83 36.91,36.84 U1.38 37.02,36.84 C102.1 36.62,36.96 v35.7,36.04 | R151.2 40.51,34.29 39.49,33.27 36.36,33.27 v36.03,33.6
  Bottom 0.254: v35.7,36.04 35.7,33.93 v36.03,33.6 35.98,33.66 33.98,33.66 32.6,32.28 v32.6,31.93
SLIC-TIP  (via drill 0.25)
  Top 0.254: U1.40 36.58,37.84 37.1,38.35 37.1,39.46 C101.1 | R103.2 38.57,22.68 37.73,21.84 34.18,21.84 33.42,22.61 33.42,24.4 R101.1 33.44,24.99 v34.38,25.93 | v35.32,38.81 35.32,39.52 35.5,39.7 36.94,39.7 C101.1 | R150.2 42.56,38.97 40.99,40.54 37.33,40.54 37.15,40.36 37.15,39.51 C101.1
  Bottom 0.254: v34.38,25.93 34.38,25.98 38.47,30.07 38.47,35.66 v35.32,38.81
SRINGC
  Top 0.406: R109.2 39.87,30.02 R107.2
STIPC
  Top 0.406: R108.2 43.87,32.47 45.61,30.73 45.61,23.85 43.81,22.05 42.94,22.05 R106.2
SVBAT
  Top 0.254: U1.22 27.12,34.6 25.7,33.17 25.7,30.89 25.19,30.38 21.94,30.38 18.86,27.3 18.86,26.17 R100.2
TIP  (via drill 0.33)
  Top 0.61: R106.1 42.84,19.1 v40.78,19.1
  Top 1.016: RF150.P2 48.28,19.3 R106.1
  Bottom 0.61: v40.78,19.1 24.38,19.1 23.36,18.08 23.36,11.61 24.32,10.64 24.32,6.65 23.18,5.51 JP2.1 17.47,5.51 15.89,3.94 14.24,3.94 12.82,5.36 RJ11.3
VBAT  (via drill 0.25)
  Top 0.254: U1.36 34.79,35.84 35.45,35.18 37.14,35.18 C105.2 37.18,35.25 v37.18,34.04 | v20.54,24.26 18.95,24.26 R100.1 13.87,24.36 R122.2
  Bottom 0.254: v37.18,34.04 37.18,30.94 30.65,24.41 20.69,24.41 v20.54,24.26
VDC
  Top 0.254: ROUTER.15 21.61,10.24 21.58,10.21 1.54,10.21 1.54,28.45 1.34,28.45 1.34,27.84
  Top 0.406: 21.88,53.75 21.82,53.75
  Top 0.61: 24.65,50.43 Q120.3 21.82,50.43 21.82,53.75 C121.1 21.82,57.38 C120.1 | 1.34,27.84 18.36,27.84 18.36,30.99 R17.1
  Top 0.813: R125.1 25.09,50.52 Q120.3
  Top 1.016: C120.1 21.87,60.05 1.24,60.05 1.24,10.21 21.58,10.21 21.61,10.21 ROUTER.15
VDDHV
  Top 0.254: U1.1 33.63,39.74 34.61,39.74 C107.2 35.74,40.41 R1.1
VDDREG
  Top 0.254: U1.19 25.7,36.84 24.12,35.25 24.12,32.38 C7.2

### Text on the board
tDocu: Model: MF01 V1.6 | One Port FXS module
214bmp: D:/SmartProjects/Snc/a4_bn_logo2.bmp